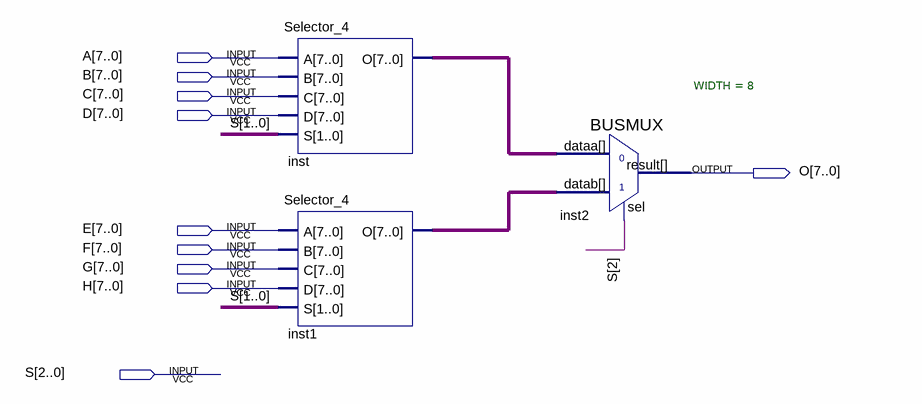
[diagram p0: schematic sheet]
// Quartus schematic Selector_8.bdf as structural Verilog: 3 symbols, 10 pins
module Selector_8 (
  input  [7:0] A,
  input  [7:0] B,
  input  [7:0] C,
  input  [7:0] D,
  input  [7:0] E,
  input  [7:0] F,
  input  [7:0] G,
  input  [7:0] H,
  input  [2:0] S,
  output [7:0] O
);

  wire [7:0] inst1_o, inst_o;

  Selector_4 inst (.A(A), .B(B), .C(C), .D(D), .S(S[1:0]), .O(inst_o));
  Selector_4 inst1 (.A(E), .B(F), .C(G), .D(H), .S(S[1:0]), .O(inst1_o));
  BUSMUX #(.WIDTH(8)) inst2 (.datab(inst1_o), .sel(S[2]), .dataa(inst_o), .result(O));
endmodule
